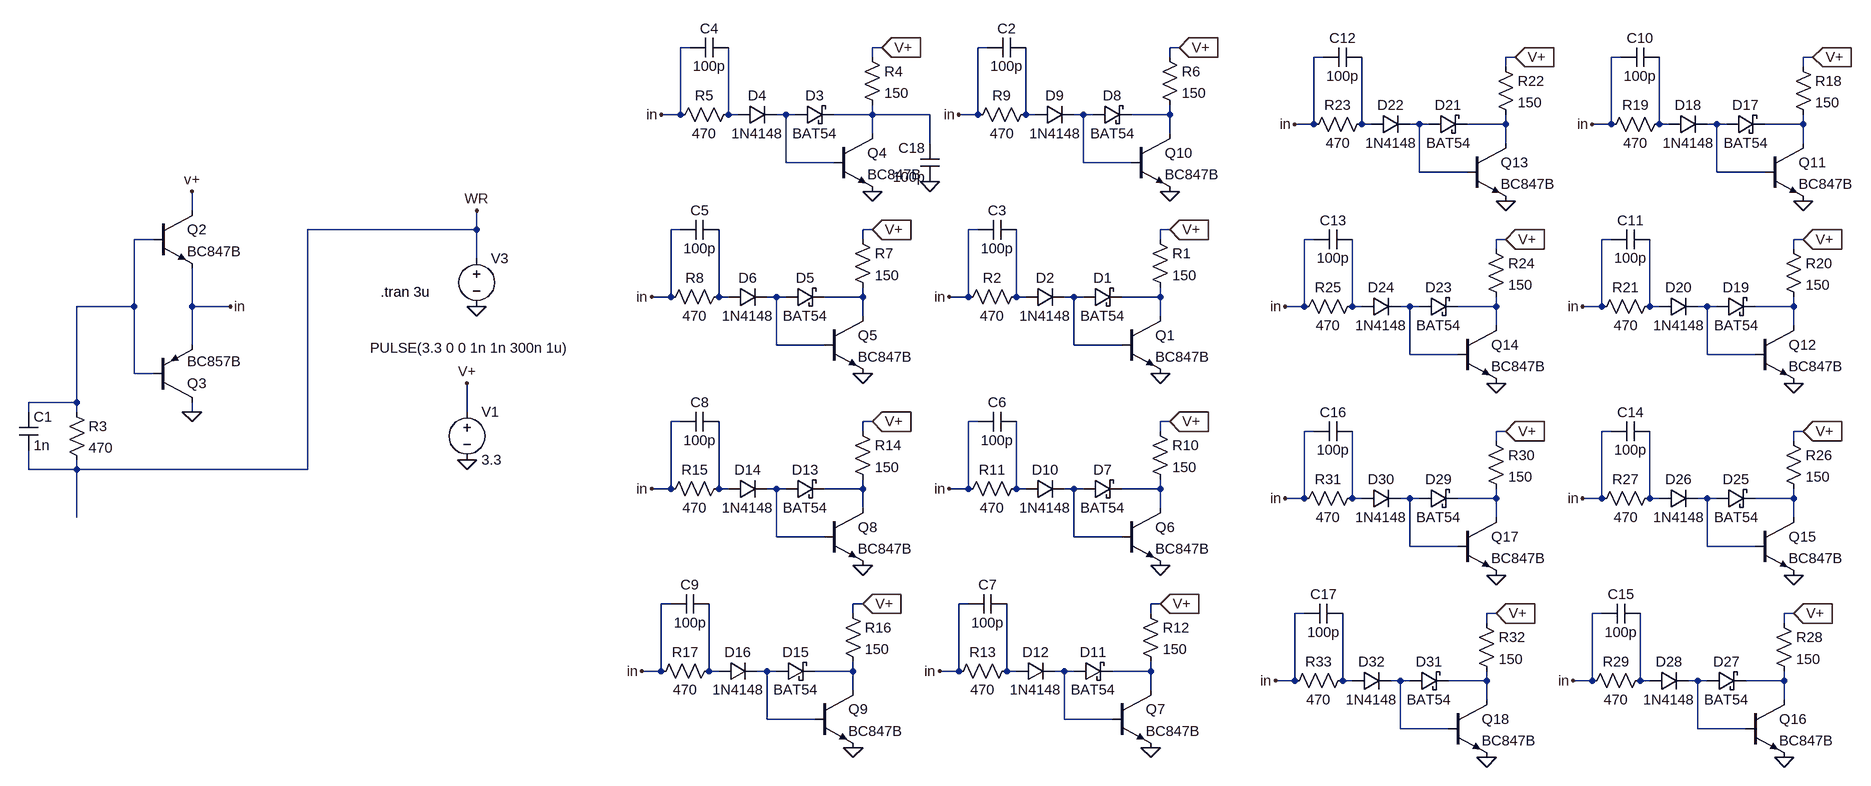
[diagram p0: schematic Pmem-driver-test.asc]
Pmem-driver-test.asc, the LTspice schematic file:
Version 4
SHEET 1 2720 784
WIRE 768 -448 752 -448
WIRE 1088 -448 1072 -448
WIRE 1264 -448 1248 -448
WIRE 1584 -448 1568 -448
WIRE 1072 -432 1072 -448
WIRE 1568 -432 1568 -448
WIRE 1824 -432 1808 -432
WIRE 2144 -432 2128 -432
WIRE 2320 -432 2304 -432
WIRE 2640 -432 2624 -432
WIRE 2128 -416 2128 -432
WIRE 2624 -416 2624 -432
WIRE 752 -336 752 -448
WIRE 752 -336 720 -336
WIRE 832 -336 832 -448
WIRE 848 -336 832 -336
WIRE 928 -336 912 -336
WIRE 944 -336 928 -336
WIRE 1072 -336 1072 -352
WIRE 1072 -336 1008 -336
WIRE 1168 -336 1072 -336
WIRE 1248 -336 1248 -448
WIRE 1248 -336 1216 -336
WIRE 1328 -336 1328 -448
WIRE 1344 -336 1328 -336
WIRE 1424 -336 1408 -336
WIRE 1440 -336 1424 -336
WIRE 1568 -336 1568 -352
WIRE 1568 -336 1504 -336
WIRE 1808 -320 1808 -432
WIRE 1808 -320 1776 -320
WIRE 1888 -320 1888 -432
WIRE 1904 -320 1888 -320
WIRE 1984 -320 1968 -320
WIRE 2000 -320 1984 -320
WIRE 2128 -320 2128 -336
WIRE 2128 -320 2064 -320
WIRE 2304 -320 2304 -432
WIRE 2304 -320 2272 -320
WIRE 2384 -320 2384 -432
WIRE 2400 -320 2384 -320
WIRE 2480 -320 2464 -320
WIRE 2496 -320 2480 -320
WIRE 2624 -320 2624 -336
WIRE 2624 -320 2560 -320
WIRE 1072 -304 1072 -336
WIRE 1568 -304 1568 -336
WIRE 1168 -288 1168 -336
WIRE 2128 -288 2128 -320
WIRE 2624 -288 2624 -320
WIRE 928 -256 928 -336
WIRE 1008 -256 928 -256
WIRE 1424 -256 1424 -336
WIRE 1504 -256 1424 -256
WIRE 1984 -240 1984 -320
WIRE 2064 -240 1984 -240
WIRE 2480 -240 2480 -320
WIRE 2560 -240 2480 -240
WIRE -544 -176 -544 -208
WIRE 64 -144 64 -176
WIRE 64 -144 -288 -144
WIRE 752 -144 736 -144
WIRE 1072 -144 1056 -144
WIRE 1248 -144 1232 -144
WIRE 1568 -144 1552 -144
WIRE -608 -128 -640 -128
WIRE 1056 -128 1056 -144
WIRE 1552 -128 1552 -144
WIRE 1808 -128 1792 -128
WIRE 2128 -128 2112 -128
WIRE 2304 -128 2288 -128
WIRE 2624 -128 2608 -128
WIRE 2112 -112 2112 -128
WIRE 2608 -112 2608 -128
WIRE 64 -96 64 -144
WIRE 736 -32 736 -144
WIRE 736 -32 704 -32
WIRE 816 -32 816 -144
WIRE 832 -32 816 -32
WIRE 912 -32 896 -32
WIRE 928 -32 912 -32
WIRE 1056 -32 1056 -48
WIRE 1056 -32 992 -32
WIRE 1232 -32 1232 -144
WIRE 1232 -32 1200 -32
WIRE 1312 -32 1312 -144
WIRE 1328 -32 1312 -32
WIRE 1408 -32 1392 -32
WIRE 1424 -32 1408 -32
WIRE 1552 -32 1552 -48
WIRE 1552 -32 1488 -32
WIRE -640 -16 -640 -128
WIRE -640 -16 -736 -16
WIRE -544 -16 -544 -80
WIRE -480 -16 -544 -16
WIRE 1792 -16 1792 -128
WIRE 1792 -16 1760 -16
WIRE 1872 -16 1872 -128
WIRE 1888 -16 1872 -16
WIRE 1968 -16 1952 -16
WIRE 1984 -16 1968 -16
WIRE 2112 -16 2112 -32
WIRE 2112 -16 2048 -16
WIRE 2288 -16 2288 -128
WIRE 2288 -16 2256 -16
WIRE 2368 -16 2368 -128
WIRE 2384 -16 2368 -16
WIRE 2464 -16 2448 -16
WIRE 2480 -16 2464 -16
WIRE 2608 -16 2608 -32
WIRE 2608 -16 2544 -16
WIRE 1056 0 1056 -32
WIRE 1552 0 1552 -32
WIRE 2112 16 2112 -16
WIRE 2608 16 2608 -16
WIRE -544 48 -544 -16
WIRE 912 48 912 -32
WIRE 992 48 912 48
WIRE 1408 48 1408 -32
WIRE 1488 48 1408 48
WIRE 1968 64 1968 -16
WIRE 2048 64 1968 64
WIRE 2464 64 2464 -16
WIRE 2544 64 2464 64
WIRE -640 96 -640 -16
WIRE -608 96 -640 96
WIRE -736 144 -736 -16
WIRE -736 144 -816 144
WIRE -816 160 -816 144
WIRE -736 160 -736 144
WIRE -544 160 -544 144
WIRE 48 160 48 112
WIRE 752 176 736 176
WIRE 1072 176 1056 176
WIRE 1248 176 1232 176
WIRE 1568 176 1552 176
WIRE 1056 192 1056 176
WIRE 1552 192 1552 176
WIRE 1808 192 1792 192
WIRE 2128 192 2112 192
WIRE 2304 192 2288 192
WIRE 2624 192 2608 192
WIRE 2112 208 2112 192
WIRE 2608 208 2608 192
WIRE -816 256 -816 224
WIRE -736 256 -736 240
WIRE -736 256 -816 256
WIRE -288 256 -288 -144
WIRE -288 256 -736 256
WIRE 736 288 736 176
WIRE 736 288 704 288
WIRE 816 288 816 176
WIRE 832 288 816 288
WIRE 912 288 896 288
WIRE 928 288 912 288
WIRE 1056 288 1056 272
WIRE 1056 288 992 288
WIRE 1232 288 1232 176
WIRE 1232 288 1200 288
WIRE 1312 288 1312 176
WIRE 1328 288 1312 288
WIRE 1408 288 1392 288
WIRE 1424 288 1408 288
WIRE 1552 288 1552 272
WIRE 1552 288 1488 288
WIRE 1792 304 1792 192
WIRE 1792 304 1760 304
WIRE 1872 304 1872 192
WIRE 1888 304 1872 304
WIRE 1968 304 1952 304
WIRE 1984 304 1968 304
WIRE 2112 304 2112 288
WIRE 2112 304 2048 304
WIRE 2288 304 2288 192
WIRE 2288 304 2256 304
WIRE 2368 304 2368 192
WIRE 2384 304 2368 304
WIRE 2464 304 2448 304
WIRE 2480 304 2464 304
WIRE 2608 304 2608 288
WIRE 2608 304 2544 304
WIRE 1056 320 1056 288
WIRE 1552 320 1552 288
WIRE -736 336 -736 256
WIRE 2112 336 2112 304
WIRE 2608 336 2608 304
WIRE 912 368 912 288
WIRE 992 368 912 368
WIRE 1408 368 1408 288
WIRE 1488 368 1408 368
WIRE 1968 384 1968 304
WIRE 2048 384 1968 384
WIRE 2464 384 2464 304
WIRE 2544 384 2464 384
WIRE 736 480 720 480
WIRE 1056 480 1040 480
WIRE 1232 480 1216 480
WIRE 1552 480 1536 480
WIRE 1040 496 1040 480
WIRE 1536 496 1536 480
WIRE 1792 496 1776 496
WIRE 2112 496 2096 496
WIRE 2288 496 2272 496
WIRE 2608 496 2592 496
WIRE 2096 512 2096 496
WIRE 2592 512 2592 496
WIRE 720 592 720 480
WIRE 720 592 688 592
WIRE 800 592 800 480
WIRE 816 592 800 592
WIRE 896 592 880 592
WIRE 912 592 896 592
WIRE 1040 592 1040 576
WIRE 1040 592 976 592
WIRE 1216 592 1216 480
WIRE 1216 592 1184 592
WIRE 1296 592 1296 480
WIRE 1312 592 1296 592
WIRE 1392 592 1376 592
WIRE 1408 592 1392 592
WIRE 1536 592 1536 576
WIRE 1536 592 1472 592
WIRE 1776 608 1776 496
WIRE 1776 608 1744 608
WIRE 1856 608 1856 496
WIRE 1872 608 1856 608
WIRE 1952 608 1936 608
WIRE 1968 608 1952 608
WIRE 2096 608 2096 592
WIRE 2096 608 2032 608
WIRE 2272 608 2272 496
WIRE 2272 608 2240 608
WIRE 2352 608 2352 496
WIRE 2368 608 2352 608
WIRE 2448 608 2432 608
WIRE 2464 608 2448 608
WIRE 2592 608 2592 592
WIRE 2592 608 2528 608
WIRE 1040 624 1040 592
WIRE 1536 624 1536 592
WIRE 2096 640 2096 608
WIRE 2592 640 2592 608
WIRE 896 672 896 592
WIRE 976 672 896 672
WIRE 1392 672 1392 592
WIRE 1472 672 1392 672
WIRE 1952 688 1952 608
WIRE 2032 688 1952 688
WIRE 2448 688 2448 608
WIRE 2528 688 2448 688
FLAG 48 240 0
FLAG 48 112 V+
FLAG 64 -16 0
FLAG 64 -176 WR
FLAG -544 160 0
FLAG -544 -208 v+
FLAG 1568 -208 0
FLAG 1584 -448 V+
IOPIN 1584 -448 In
FLAG -480 -16 in
FLAG 1216 -336 in
FLAG 1552 96 0
FLAG 1568 -144 V+
IOPIN 1568 -144 In
FLAG 1200 -32 in
FLAG 1072 -208 0
FLAG 1088 -448 V+
IOPIN 1088 -448 In
FLAG 720 -336 in
FLAG 1056 96 0
FLAG 1072 -144 V+
IOPIN 1072 -144 In
FLAG 704 -32 in
FLAG 1552 416 0
FLAG 1568 176 V+
IOPIN 1568 176 In
FLAG 1200 288 in
FLAG 1536 720 0
FLAG 1552 480 V+
IOPIN 1552 480 In
FLAG 1184 592 in
FLAG 1056 416 0
FLAG 1072 176 V+
IOPIN 1072 176 In
FLAG 704 288 in
FLAG 1040 720 0
FLAG 1056 480 V+
IOPIN 1056 480 In
FLAG 688 592 in
FLAG 2624 -192 0
FLAG 2640 -432 V+
IOPIN 2640 -432 In
FLAG 2272 -320 in
FLAG 2608 112 0
FLAG 2624 -128 V+
IOPIN 2624 -128 In
FLAG 2256 -16 in
FLAG 2128 -192 0
FLAG 2144 -432 V+
IOPIN 2144 -432 In
FLAG 1776 -320 in
FLAG 2112 112 0
FLAG 2128 -128 V+
IOPIN 2128 -128 In
FLAG 1760 -16 in
FLAG 2608 432 0
FLAG 2624 192 V+
IOPIN 2624 192 In
FLAG 2256 304 in
FLAG 2592 736 0
FLAG 2608 496 V+
IOPIN 2608 496 In
FLAG 2240 608 in
FLAG 2112 432 0
FLAG 2128 192 V+
IOPIN 2128 192 In
FLAG 1760 304 in
FLAG 2096 736 0
FLAG 2112 496 V+
IOPIN 2112 496 In
FLAG 1744 608 in
FLAG 1168 -224 0
SYMBOL voltage 48 144 R0
SYMATTR InstName V1
SYMATTR Value 3.3
SYMBOL voltage 64 -112 R0
WINDOW 3 -178 165 Left 2
SYMATTR InstName V3
SYMATTR Value PULSE(3.3 0 0 1n 1n 300n 1u)
SYMBOL cap -832 160 R0
SYMATTR InstName C1
SYMATTR Value 1n
SYMBOL npn -608 -176 R0
SYMATTR InstName Q2
SYMATTR Value BC847B
SYMBOL pnp -608 144 M180
SYMATTR InstName Q3
SYMATTR Value BC857B
SYMBOL res -752 144 R0
SYMATTR InstName R3
SYMATTR Value 470
SYMBOL npn 1504 -304 R0
SYMATTR InstName Q10
SYMATTR Value BC847B
SYMBOL schottky 1440 -320 R270
WINDOW 0 32 32 VTop 2
WINDOW 3 0 32 VBottom 2
SYMATTR InstName D8
SYMATTR Value BAT54
SYMATTR Description Diode
SYMATTR Type diode
SYMBOL diode 1344 -352 M90
WINDOW 0 0 32 VBottom 2
WINDOW 3 32 32 VTop 2
SYMATTR InstName D9
SYMATTR Value 1N4148
SYMBOL res 1552 -448 R0
SYMATTR InstName R6
SYMATTR Value 150
SYMBOL res 1344 -352 R90
WINDOW 0 0 56 VBottom 2
WINDOW 3 32 56 VTop 2
SYMATTR InstName R9
SYMATTR Value 470
SYMBOL cap 1328 -464 R90
WINDOW 0 0 32 VBottom 2
WINDOW 3 32 32 VTop 2
SYMATTR InstName C2
SYMATTR Value 100p
SYMBOL npn 1488 0 R0
SYMATTR InstName Q1
SYMATTR Value BC847B
SYMBOL schottky 1424 -16 R270
WINDOW 0 32 32 VTop 2
WINDOW 3 0 32 VBottom 2
SYMATTR InstName D1
SYMATTR Value BAT54
SYMATTR Description Diode
SYMATTR Type diode
SYMBOL diode 1328 -48 M90
WINDOW 0 0 32 VBottom 2
WINDOW 3 32 32 VTop 2
SYMATTR InstName D2
SYMATTR Value 1N4148
SYMBOL res 1536 -144 R0
SYMATTR InstName R1
SYMATTR Value 150
SYMBOL res 1328 -48 R90
WINDOW 0 0 56 VBottom 2
WINDOW 3 32 56 VTop 2
SYMATTR InstName R2
SYMATTR Value 470
SYMBOL cap 1312 -160 R90
WINDOW 0 0 32 VBottom 2
WINDOW 3 32 32 VTop 2
SYMATTR InstName C3
SYMATTR Value 100p
SYMBOL npn 1008 -304 R0
SYMATTR InstName Q4
SYMATTR Value BC847B
SYMBOL schottky 944 -320 R270
WINDOW 0 32 32 VTop 2
WINDOW 3 0 32 VBottom 2
SYMATTR InstName D3
SYMATTR Value BAT54
SYMATTR Description Diode
SYMATTR Type diode
SYMBOL diode 848 -352 M90
WINDOW 0 0 32 VBottom 2
WINDOW 3 32 32 VTop 2
SYMATTR InstName D4
SYMATTR Value 1N4148
SYMBOL res 1056 -448 R0
SYMATTR InstName R4
SYMATTR Value 150
SYMBOL res 848 -352 R90
WINDOW 0 0 56 VBottom 2
WINDOW 3 32 56 VTop 2
SYMATTR InstName R5
SYMATTR Value 470
SYMBOL cap 832 -464 R90
WINDOW 0 0 32 VBottom 2
WINDOW 3 32 32 VTop 2
SYMATTR InstName C4
SYMATTR Value 100p
SYMBOL npn 992 0 R0
SYMATTR InstName Q5
SYMATTR Value BC847B
SYMBOL schottky 928 -16 R270
WINDOW 0 32 32 VTop 2
WINDOW 3 0 32 VBottom 2
SYMATTR InstName D5
SYMATTR Value BAT54
SYMATTR Description Diode
SYMATTR Type diode
SYMBOL diode 832 -48 M90
WINDOW 0 0 32 VBottom 2
WINDOW 3 32 32 VTop 2
SYMATTR InstName D6
SYMATTR Value 1N4148
SYMBOL res 1040 -144 R0
SYMATTR InstName R7
SYMATTR Value 150
SYMBOL res 832 -48 R90
WINDOW 0 0 56 VBottom 2
WINDOW 3 32 56 VTop 2
SYMATTR InstName R8
SYMATTR Value 470
SYMBOL cap 816 -160 R90
WINDOW 0 0 32 VBottom 2
WINDOW 3 32 32 VTop 2
SYMATTR InstName C5
SYMATTR Value 100p
SYMBOL npn 1488 320 R0
SYMATTR InstName Q6
SYMATTR Value BC847B
SYMBOL schottky 1424 304 R270
WINDOW 0 32 32 VTop 2
WINDOW 3 0 32 VBottom 2
SYMATTR InstName D7
SYMATTR Value BAT54
SYMATTR Description Diode
SYMATTR Type diode
SYMBOL diode 1328 272 M90
WINDOW 0 0 32 VBottom 2
WINDOW 3 32 32 VTop 2
SYMATTR InstName D10
SYMATTR Value 1N4148
SYMBOL res 1536 176 R0
SYMATTR InstName R10
SYMATTR Value 150
SYMBOL res 1328 272 R90
WINDOW 0 0 56 VBottom 2
WINDOW 3 32 56 VTop 2
SYMATTR InstName R11
SYMATTR Value 470
SYMBOL cap 1312 160 R90
WINDOW 0 0 32 VBottom 2
WINDOW 3 32 32 VTop 2
SYMATTR InstName C6
SYMATTR Value 100p
SYMBOL npn 1472 624 R0
SYMATTR InstName Q7
SYMATTR Value BC847B
SYMBOL schottky 1408 608 R270
WINDOW 0 32 32 VTop 2
WINDOW 3 0 32 VBottom 2
SYMATTR InstName D11
SYMATTR Value BAT54
SYMATTR Description Diode
SYMATTR Type diode
SYMBOL diode 1312 576 M90
WINDOW 0 0 32 VBottom 2
WINDOW 3 32 32 VTop 2
SYMATTR InstName D12
SYMATTR Value 1N4148
SYMBOL res 1520 480 R0
SYMATTR InstName R12
SYMATTR Value 150
SYMBOL res 1312 576 R90
WINDOW 0 0 56 VBottom 2
WINDOW 3 32 56 VTop 2
SYMATTR InstName R13
SYMATTR Value 470
SYMBOL cap 1296 464 R90
WINDOW 0 0 32 VBottom 2
WINDOW 3 32 32 VTop 2
SYMATTR InstName C7
SYMATTR Value 100p
SYMBOL npn 992 320 R0
SYMATTR InstName Q8
SYMATTR Value BC847B
SYMBOL schottky 928 304 R270
WINDOW 0 32 32 VTop 2
WINDOW 3 0 32 VBottom 2
SYMATTR InstName D13
SYMATTR Value BAT54
SYMATTR Description Diode
SYMATTR Type diode
SYMBOL diode 832 272 M90
WINDOW 0 0 32 VBottom 2
WINDOW 3 32 32 VTop 2
SYMATTR InstName D14
SYMATTR Value 1N4148
SYMBOL res 1040 176 R0
SYMATTR InstName R14
SYMATTR Value 150
SYMBOL res 832 272 R90
WINDOW 0 0 56 VBottom 2
WINDOW 3 32 56 VTop 2
SYMATTR InstName R15
SYMATTR Value 470
SYMBOL cap 816 160 R90
WINDOW 0 0 32 VBottom 2
WINDOW 3 32 32 VTop 2
SYMATTR InstName C8
SYMATTR Value 100p
SYMBOL npn 976 624 R0
SYMATTR InstName Q9
SYMATTR Value BC847B
SYMBOL schottky 912 608 R270
WINDOW 0 32 32 VTop 2
WINDOW 3 0 32 VBottom 2
SYMATTR InstName D15
SYMATTR Value BAT54
SYMATTR Description Diode
SYMATTR Type diode
SYMBOL diode 816 576 M90
WINDOW 0 0 32 VBottom 2
WINDOW 3 32 32 VTop 2
SYMATTR InstName D16
SYMATTR Value 1N4148
SYMBOL res 1024 480 R0
SYMATTR InstName R16
SYMATTR Value 150
SYMBOL res 816 576 R90
WINDOW 0 0 56 VBottom 2
WINDOW 3 32 56 VTop 2
SYMATTR InstName R17
SYMATTR Value 470
SYMBOL cap 800 464 R90
WINDOW 0 0 32 VBottom 2
WINDOW 3 32 32 VTop 2
SYMATTR InstName C9
SYMATTR Value 100p
SYMBOL npn 2560 -288 R0
SYMATTR InstName Q11
SYMATTR Value BC847B
SYMBOL schottky 2496 -304 R270
WINDOW 0 32 32 VTop 2
WINDOW 3 0 32 VBottom 2
SYMATTR InstName D17
SYMATTR Value BAT54
SYMATTR Description Diode
SYMATTR Type diode
SYMBOL diode 2400 -336 M90
WINDOW 0 0 32 VBottom 2
WINDOW 3 32 32 VTop 2
SYMATTR InstName D18
SYMATTR Value 1N4148
SYMBOL res 2608 -432 R0
SYMATTR InstName R18
SYMATTR Value 150
SYMBOL res 2400 -336 R90
WINDOW 0 0 56 VBottom 2
WINDOW 3 32 56 VTop 2
SYMATTR InstName R19
SYMATTR Value 470
SYMBOL cap 2384 -448 R90
WINDOW 0 0 32 VBottom 2
WINDOW 3 32 32 VTop 2
SYMATTR InstName C10
SYMATTR Value 100p
SYMBOL npn 2544 16 R0
SYMATTR InstName Q12
SYMATTR Value BC847B
SYMBOL schottky 2480 0 R270
WINDOW 0 32 32 VTop 2
WINDOW 3 0 32 VBottom 2
SYMATTR InstName D19
SYMATTR Value BAT54
SYMATTR Description Diode
SYMATTR Type diode
SYMBOL diode 2384 -32 M90
WINDOW 0 0 32 VBottom 2
WINDOW 3 32 32 VTop 2
SYMATTR InstName D20
SYMATTR Value 1N4148
SYMBOL res 2592 -128 R0
SYMATTR InstName R20
SYMATTR Value 150
SYMBOL res 2384 -32 R90
WINDOW 0 0 56 VBottom 2
WINDOW 3 32 56 VTop 2
SYMATTR InstName R21
SYMATTR Value 470
SYMBOL cap 2368 -144 R90
WINDOW 0 0 32 VBottom 2
WINDOW 3 32 32 VTop 2
SYMATTR InstName C11
SYMATTR Value 100p
SYMBOL npn 2064 -288 R0
SYMATTR InstName Q13
SYMATTR Value BC847B
SYMBOL schottky 2000 -304 R270
WINDOW 0 32 32 VTop 2
WINDOW 3 0 32 VBottom 2
SYMATTR InstName D21
SYMATTR Value BAT54
SYMATTR Description Diode
SYMATTR Type diode
SYMBOL diode 1904 -336 M90
WINDOW 0 0 32 VBottom 2
WINDOW 3 32 32 VTop 2
SYMATTR InstName D22
SYMATTR Value 1N4148
SYMBOL res 2112 -432 R0
SYMATTR InstName R22
SYMATTR Value 150
SYMBOL res 1904 -336 R90
WINDOW 0 0 56 VBottom 2
WINDOW 3 32 56 VTop 2
SYMATTR InstName R23
SYMATTR Value 470
SYMBOL cap 1888 -448 R90
WINDOW 0 0 32 VBottom 2
WINDOW 3 32 32 VTop 2
SYMATTR InstName C12
SYMATTR Value 100p
SYMBOL npn 2048 16 R0
SYMATTR InstName Q14
SYMATTR Value BC847B
SYMBOL schottky 1984 0 R270
WINDOW 0 32 32 VTop 2
WINDOW 3 0 32 VBottom 2
SYMATTR InstName D23
SYMATTR Value BAT54
SYMATTR Description Diode
SYMATTR Type diode
SYMBOL diode 1888 -32 M90
WINDOW 0 0 32 VBottom 2
WINDOW 3 32 32 VTop 2
SYMATTR InstName D24
SYMATTR Value 1N4148
SYMBOL res 2096 -128 R0
SYMATTR InstName R24
SYMATTR Value 150
SYMBOL res 1888 -32 R90
WINDOW 0 0 56 VBottom 2
WINDOW 3 32 56 VTop 2
SYMATTR InstName R25
SYMATTR Value 470
SYMBOL cap 1872 -144 R90
WINDOW 0 0 32 VBottom 2
WINDOW 3 32 32 VTop 2
SYMATTR InstName C13
SYMATTR Value 100p
SYMBOL npn 2544 336 R0
SYMATTR InstName Q15
SYMATTR Value BC847B
SYMBOL schottky 2480 320 R270
WINDOW 0 32 32 VTop 2
WINDOW 3 0 32 VBottom 2
SYMATTR InstName D25
SYMATTR Value BAT54
SYMATTR Description Diode
SYMATTR Type diode
SYMBOL diode 2384 288 M90
WINDOW 0 0 32 VBottom 2
WINDOW 3 32 32 VTop 2
SYMATTR InstName D26
SYMATTR Value 1N4148
SYMBOL res 2592 192 R0
SYMATTR InstName R26
SYMATTR Value 150
SYMBOL res 2384 288 R90
WINDOW 0 0 56 VBottom 2
WINDOW 3 32 56 VTop 2
SYMATTR InstName R27
SYMATTR Value 470
SYMBOL cap 2368 176 R90
WINDOW 0 0 32 VBottom 2
WINDOW 3 32 32 VTop 2
SYMATTR InstName C14
SYMATTR Value 100p
SYMBOL npn 2528 640 R0
SYMATTR InstName Q16
SYMATTR Value BC847B
SYMBOL schottky 2464 624 R270
WINDOW 0 32 32 VTop 2
WINDOW 3 0 32 VBottom 2
SYMATTR InstName D27
SYMATTR Value BAT54
SYMATTR Description Diode
SYMATTR Type diode
SYMBOL diode 2368 592 M90
WINDOW 0 0 32 VBottom 2
WINDOW 3 32 32 VTop 2
SYMATTR InstName D28
SYMATTR Value 1N4148
SYMBOL res 2576 496 R0
SYMATTR InstName R28
SYMATTR Value 150
SYMBOL res 2368 592 R90
WINDOW 0 0 56 VBottom 2
WINDOW 3 32 56 VTop 2
SYMATTR InstName R29
SYMATTR Value 470
SYMBOL cap 2352 480 R90
WINDOW 0 0 32 VBottom 2
WINDOW 3 32 32 VTop 2
SYMATTR InstName C15
SYMATTR Value 100p
SYMBOL npn 2048 336 R0
SYMATTR InstName Q17
SYMATTR Value BC847B
SYMBOL schottky 1984 320 R270
WINDOW 0 32 32 VTop 2
WINDOW 3 0 32 VBottom 2
SYMATTR InstName D29
SYMATTR Value BAT54
SYMATTR Description Diode
SYMATTR Type diode
SYMBOL diode 1888 288 M90
WINDOW 0 0 32 VBottom 2
WINDOW 3 32 32 VTop 2
SYMATTR InstName D30
SYMATTR Value 1N4148
SYMBOL res 2096 192 R0
SYMATTR InstName R30
SYMATTR Value 150
SYMBOL res 1888 288 R90
WINDOW 0 0 56 VBottom 2
WINDOW 3 32 56 VTop 2
SYMATTR InstName R31
SYMATTR Value 470
SYMBOL cap 1872 176 R90
WINDOW 0 0 32 VBottom 2
WINDOW 3 32 32 VTop 2
SYMATTR InstName C16
SYMATTR Value 100p
SYMBOL npn 2032 640 R0
SYMATTR InstName Q18
SYMATTR Value BC847B
SYMBOL schottky 1968 624 R270
WINDOW 0 32 32 VTop 2
WINDOW 3 0 32 VBottom 2
SYMATTR InstName D31
SYMATTR Value BAT54
SYMATTR Description Diode
SYMATTR Type diode
SYMBOL diode 1872 592 M90
WINDOW 0 0 32 VBottom 2
WINDOW 3 32 32 VTop 2
SYMATTR InstName D32
SYMATTR Value 1N4148
SYMBOL res 2080 496 R0
SYMATTR InstName R32
SYMATTR Value 150
SYMBOL res 1872 592 R90
WINDOW 0 0 56 VBottom 2
WINDOW 3 32 56 VTop 2
SYMATTR InstName R33
SYMATTR Value 470
SYMBOL cap 1856 480 R90
WINDOW 0 0 32 VBottom 2
WINDOW 3 32 32 VTop 2
SYMATTR InstName C17
SYMATTR Value 100p
SYMBOL cap 1184 -224 R180
WINDOW 0 24 56 Left 2
WINDOW 3 24 8 Left 2
SYMATTR InstName C18
SYMATTR Value 100p
TEXT -96 -40 Left 2 !.tran 3u

The netlist it stands for:
* Pmem-driver-test.asc
V1 V+ 0 3.3
V3 WR 0 PULSE(3.3 0 0 1n 1n 300n 1u)
C1 N013 WR 1n
Q2 V+ N013 in 0 BC847B
Q3 0 N013 in 0 BC857B
R3 N013 WR 470
Q10 N006 N005 0 0 BC847B
D8 N005 N006 BAT54
D9 N004 N005 1N4148
R6 V+ N006 150
R9 N004 in 470
C2 N004 in 100p
Q1 N019 N018 0 0 BC847B
D1 N018 N019 BAT54
D2 N017 N018 1N4148
R1 V+ N019 150
R2 N017 in 470
C3 N017 in 100p
Q4 N003 N002 0 0 BC847B
D3 N002 N003 BAT54
D4 N001 N002 1N4148
R4 V+ N003 150
R5 N001 in 470
C4 N001 in 100p
Q5 N016 N015 0 0 BC847B
D5 N015 N016 BAT54
D6 N014 N015 1N4148
R7 V+ N016 150
R8 N014 in 470
C5 N014 in 100p
Q6 N031 N030 0 0 BC847B
D7 N030 N031 BAT54
D10 N029 N030 1N4148
R10 V+ N031 150
R11 N029 in 470
C6 N029 in 100p
Q7 N043 N042 0 0 BC847B
D11 N042 N043 BAT54
D12 N041 N042 1N4148
R12 V+ N043 150
R13 N041 in 470
C7 N041 in 100p
Q8 N028 N027 0 0 BC847B
D13 N027 N028 BAT54
D14 N026 N027 1N4148
R14 V+ N028 150
R15 N026 in 470
C8 N026 in 100p
Q9 N040 N039 0 0 BC847B
D15 N039 N040 BAT54
D16 N038 N039 1N4148
R16 V+ N040 150
R17 N038 in 470
C9 N038 in 100p
Q11 N012 N011 0 0 BC847B
D17 N011 N012 BAT54
D18 N010 N011 1N4148
R18 V+ N012 150
R19 N010 in 470
C10 N010 in 100p
Q12 N025 N024 0 0 BC847B
D19 N024 N025 BAT54
D20 N023 N024 1N4148
R20 V+ N025 150
R21 N023 in 470
C11 N023 in 100p
Q13 N009 N008 0 0 BC847B
D21 N008 N009 BAT54
D22 N007 N008 1N4148
R22 V+ N009 150
R23 N007 in 470
C12 N007 in 100p
Q14 N022 N021 0 0 BC847B
D23 N021 N022 BAT54
D24 N020 N021 1N4148
R24 V+ N022 150
R25 N020 in 470
C13 N020 in 100p
Q15 N037 N036 0 0 BC847B
D25 N036 N037 BAT54
D26 N035 N036 1N4148
R26 V+ N037 150
R27 N035 in 470
C14 N035 in 100p
Q16 N049 N048 0 0 BC847B
D27 N048 N049 BAT54
D28 N047 N048 1N4148
R28 V+ N049 150
R29 N047 in 470
C15 N047 in 100p
Q17 N034 N033 0 0 BC847B
D29 N033 N034 BAT54
D30 N032 N033 1N4148
R30 V+ N034 150
R31 N032 in 470
C16 N032 in 100p
Q18 N046 N045 0 0 BC847B
D31 N045 N046 BAT54
D32 N044 N045 1N4148
R32 V+ N046 150
R33 N044 in 470
C17 N044 in 100p
C18 0 N003 100p
.model D D
.lib standard.dio
.model NPN NPN
.model PNP PNP
.lib standard.bjt
.tran 3u
.backanno
.end